# Altium schematic sheet Porta_MDB.SchDoc: CONTROLADORA MAIS PIPOCA - REVISÃO EMC
size A3; DocumentNumber: 16; SheetNumber: 16; SheetTotal: 17
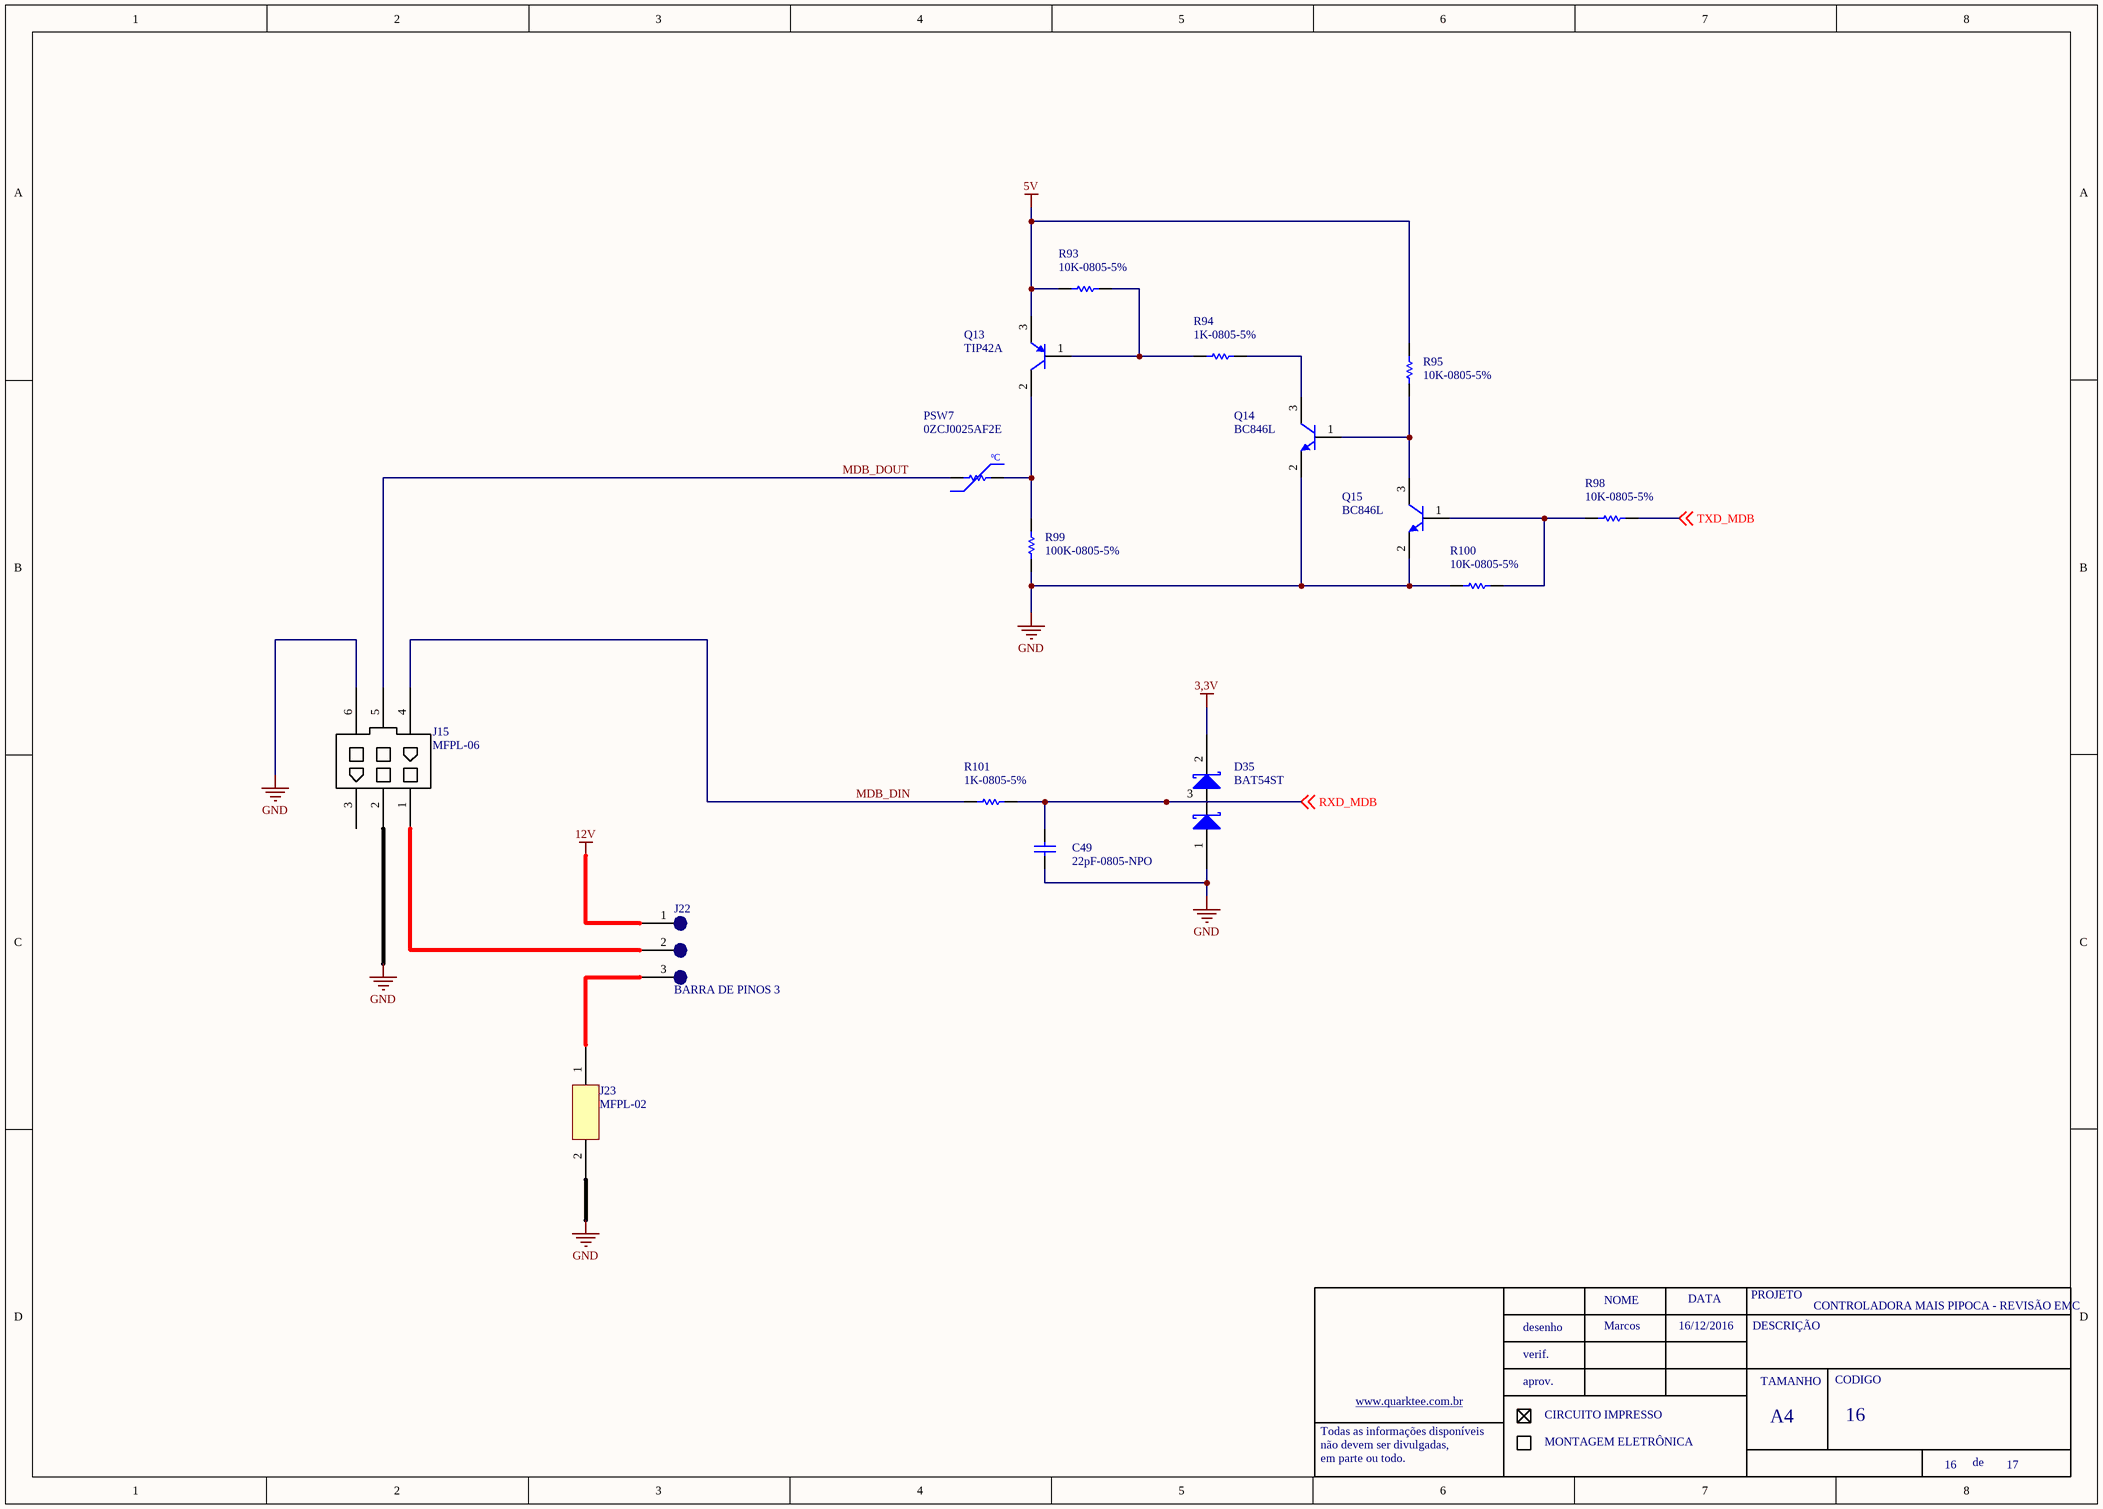
[diagram p0: Porta_MDB.SchDoc]

## Parts
C49  22pF-0805-NPO  [0805-REVISADO ONDA]
D35  BAT54ST  [SOT23 - REVISADO ONDA]
J15  MFPL-06
J22  BARRA DE PINOS 3
J23  MFPL-02
PSW7  0ZCJ0025AF2E  [1206-REVISADO ONDA]
Q13  TIP42A  [DPAK REVISADO ONDA]
Q14  BC846L  [SOT23 - REVISADO ONDA]
Q15  BC846L  [SOT23 - REVISADO ONDA]
R93  10K-0805-5%  [0805-REVISADO ONDA]
R94  1K-0805-5%  [0805-REVISADO ONDA]
R95  10K-0805-5%  [0805-REVISADO ONDA]
R98  10K-0805-5%  [0805-REVISADO ONDA]
R99  100K-0805-5%  [0805-REVISADO ONDA]
R100  10K-0805-5%  [0805-REVISADO ONDA]
R101  1K-0805-5%  [0805-REVISADO ONDA]

## Nets
3,3V: D35.2
5V: Q13.3(E) R93.1 R95.2
12V: J22.1
GND: C49.1 D35.1 J15.2 J15.6 J23.2 Q14.2(E) Q15.2(E) R99.1 R100.1
MDB_DIN: J15.4 R101.1
MDB_DOUT: J15.5 PSW7.1
RXD_MDB: C49.2 D35.3 R101.2 ; off-sheet RXD_MDB
TXD_MDB: R98.2 ; off-sheet TXD_MDB
NetJ15_1: J15.1 J22.2
NetJ22_3: J22.3 J23.1
NetPSW7_2: PSW7.2 Q13.2(C) R99.2
NetQ13_1: Q13.1(B) R93.2 R94.1
NetQ14_1: Q14.1(B) Q15.3(C) R95.1
NetQ14_3: Q14.3(C) R94.2
NetQ15_1: Q15.1(B) R98.1 R100.2

Not connected (* = marked no-connect by the designer): J15 3

## Notes on the sheet
- Marcos
- 16/12/2016
- NOME
- DATA
- PROJETO
- DESCRIÇÃO
- desenho
- verif.
- aprov.
- TAMANHO
- CODIGO
- Todas as informações disponíveis
- não devem ser divulgadas,
- em parte ou todo.
- www.quarktee.com.br
- CIRCUITO IMPRESSO
- MONTAGEM ELETRÔNICA
- A4
- de
- (in symbol PTC 2A-120V) ºC

## Library data of the parts
J22 = JUMPER 3
PSW7 = PTC 2A-120V
Q14 Q15 = BC846: ERP: 106.22.001
C49 = 22pF-0805-NPO: ERP: 104.11.001
Q13 = TIP42A: ERP: 107.01.007
R93 R95 R98 R100 = 10K-0805-5%: ERP: 102.11.054
R94 R101 = 1K-0805-5%: ERP: 102.11.042
R99 = 100K-0805-5%: ERP: 102.11.066